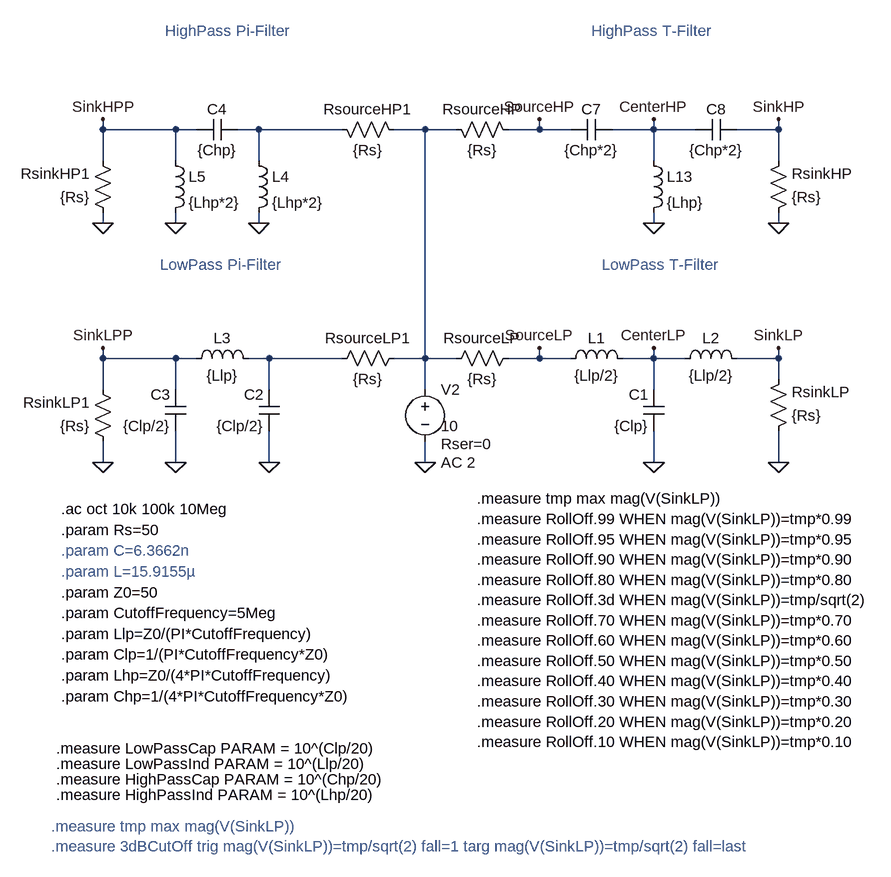
[diagram p0: schematic Filter.asc]
Filter.asc, the LTspice schematic file:
Version 4
SHEET 1 1248 680
WIRE -1056 -576 -1056 -592
WIRE -944 -576 -1056 -576
WIRE -912 -576 -944 -576
WIRE -816 -576 -848 -576
WIRE -688 -576 -816 -576
WIRE -560 -576 -608 -576
WIRE -512 -576 -560 -576
WIRE -384 -576 -384 -592
WIRE -384 -576 -432 -576
WIRE -336 -576 -384 -576
WIRE -208 -576 -208 -592
WIRE -208 -576 -272 -576
WIRE -144 -576 -208 -576
WIRE -16 -576 -16 -592
WIRE -16 -576 -80 -576
WIRE -1056 -528 -1056 -576
WIRE -944 -528 -944 -576
WIRE -816 -528 -816 -576
WIRE -208 -528 -208 -576
WIRE -16 -528 -16 -576
WIRE -1056 -432 -1056 -448
WIRE -944 -432 -944 -448
WIRE -816 -432 -816 -448
WIRE -208 -432 -208 -448
WIRE -16 -432 -16 -448
WIRE -1056 -224 -1056 -240
WIRE -944 -224 -1056 -224
WIRE -912 -224 -944 -224
WIRE -800 -224 -832 -224
WIRE -688 -224 -800 -224
WIRE -560 -224 -560 -576
WIRE -560 -224 -608 -224
WIRE -512 -224 -560 -224
WIRE -384 -224 -384 -240
WIRE -384 -224 -432 -224
WIRE -336 -224 -384 -224
WIRE -208 -224 -208 -240
WIRE -208 -224 -256 -224
WIRE -160 -224 -208 -224
WIRE -16 -224 -16 -240
WIRE -16 -224 -80 -224
WIRE -16 -192 -16 -224
WIRE -1056 -176 -1056 -224
WIRE -944 -176 -944 -224
WIRE -800 -176 -800 -224
WIRE -560 -176 -560 -224
WIRE -208 -176 -208 -224
WIRE -1056 -64 -1056 -96
WIRE -944 -64 -944 -112
WIRE -800 -64 -800 -112
WIRE -560 -64 -560 -96
WIRE -208 -64 -208 -112
WIRE -16 -64 -16 -112
FLAG -560 -64 0
FLAG -16 -64 0
FLAG -208 -64 0
FLAG -384 -240 SourceLP
FLAG -16 -240 SinkLP
FLAG -208 -240 CenterLP
FLAG -208 -432 0
FLAG -16 -432 0
FLAG -16 -592 SinkHP
FLAG -384 -592 SourceHP
FLAG -208 -592 CenterHP
FLAG -800 -64 0
FLAG -1056 -64 0
FLAG -944 -64 0
FLAG -1056 -240 SinkLPP
FLAG -816 -432 0
FLAG -944 -432 0
FLAG -1056 -432 0
FLAG -1056 -592 SinkHPP
SYMBOL voltage -560 -192 R0
WINDOW 3 24 72 Left 2
WINDOW 39 24 100 Left 2
WINDOW 123 24 128 Left 2
SYMATTR Value 10
SYMATTR SpiceLine Rser=0
SYMATTR Value2 AC 2
SYMATTR InstName V2
SYMBOL cap -192 -112 R180
WINDOW 0 24 56 Left 2
WINDOW 3 24 8 Left 2
SYMATTR InstName C1
SYMATTR Value {Clp}
SYMBOL ind -352 -208 R270
WINDOW 0 32 56 VTop 2
WINDOW 3 5 56 VBottom 2
SYMATTR InstName L1
SYMATTR Value {Llp/2}
SYMBOL res -416 -240 R90
WINDOW 0 0 56 VBottom 2
WINDOW 3 32 56 VTop 2
SYMATTR InstName RsourceLP
SYMATTR Value {Rs}
SYMBOL res -32 -96 M180
WINDOW 0 36 76 Left 2
WINDOW 3 36 40 Left 2
SYMATTR InstName RsinkLP
SYMATTR Value {Rs}
SYMBOL ind -176 -208 R270
WINDOW 0 32 56 VTop 2
WINDOW 3 5 56 VBottom 2
SYMATTR InstName L2
SYMATTR Value {Llp/2}
SYMBOL res -528 -592 M90
WINDOW 0 0 56 VBottom 2
WINDOW 3 32 56 VTop 2
SYMATTR InstName RsourceHP
SYMATTR Value {Rs}
SYMBOL cap -336 -560 R270
WINDOW 0 32 32 VTop 2
WINDOW 3 0 32 VBottom 2
SYMATTR InstName C7
SYMATTR Value {Chp*2}
SYMBOL cap -144 -560 R270
WINDOW 0 32 32 VTop 2
WINDOW 3 0 32 VBottom 2
SYMATTR InstName C8
SYMATTR Value {Chp*2}
SYMBOL ind -224 -544 R0
SYMATTR InstName L13
SYMATTR Value {Lhp}
SYMBOL res -32 -432 M180
WINDOW 0 36 76 Left 2
WINDOW 3 36 40 Left 2
SYMATTR InstName RsinkHP
SYMATTR Value {Rs}
SYMBOL cap -784 -112 R180
WINDOW 0 24 56 Left 2
WINDOW 3 24 8 Left 2
SYMATTR InstName C2
SYMATTR Value {Clp/2}
SYMBOL res -1040 -80 R180
WINDOW 0 36 76 Left 2
WINDOW 3 36 40 Left 2
SYMATTR InstName RsinkLP1
SYMATTR Value {Rs}
SYMBOL res -592 -240 R90
WINDOW 0 0 56 VBottom 2
WINDOW 3 32 56 VTop 2
SYMATTR InstName RsourceLP1
SYMATTR Value {Rs}
SYMBOL cap -928 -112 R180
WINDOW 0 24 56 Left 2
WINDOW 3 24 8 Left 2
SYMATTR InstName C3
SYMATTR Value {Clp/2}
SYMBOL ind -928 -208 R270
WINDOW 0 32 56 VTop 2
WINDOW 3 5 56 VBottom 2
SYMATTR InstName L3
SYMATTR Value {Llp}
SYMBOL cap -912 -560 R270
WINDOW 0 32 32 VTop 2
WINDOW 3 0 32 VBottom 2
SYMATTR InstName C4
SYMATTR Value {Chp}
SYMBOL ind -832 -544 R0
SYMATTR InstName L4
SYMATTR Value {Lhp*2}
SYMBOL ind -960 -544 R0
SYMATTR InstName L5
SYMATTR Value {Lhp*2}
SYMBOL res -1040 -432 R180
WINDOW 0 36 76 Left 2
WINDOW 3 36 40 Left 2
SYMATTR InstName RsinkHP1
SYMATTR Value {Rs}
SYMBOL res -704 -592 M90
WINDOW 0 0 56 VBottom 2
WINDOW 3 32 56 VTop 2
SYMATTR InstName RsourceHP1
SYMATTR Value {Rs}
TEXT -1120 8 Left 2 !.ac oct 10k 100k 10Meg
TEXT -1120 40 Left 2 !.param Rs=50
TEXT -1120 72 Left 2 ;.param C=6.3662n
TEXT -960 -728 Left 2 ;HighPass Pi-Filter
TEXT -304 -728 Left 2 ;HighPass T-Filter
TEXT -968 -368 Left 2 ;LowPass Pi-Filter
TEXT -288 -368 Left 2 ;LowPass T-Filter
TEXT -1120 104 Left 2 ;.param L=15.9155µ
TEXT -1120 232 Left 2 !.param Clp=1/(PI*CutoffFrequency*Z0)
TEXT -1120 136 Left 2 !.param Z0=50
TEXT -1120 168 Left 2 !.param CutoffFrequency=5Meg
TEXT -1120 200 Left 2 !.param Llp=Z0/(PI*CutoffFrequency)
TEXT -480 -8 Left 2 !.measure tmp max mag(V(SinkLP))\n.measure RollOff.99 WHEN mag(V(SinkLP))=tmp*0.99\n.measure RollOff.95 WHEN mag(V(SinkLP))=tmp*0.95\n.measure RollOff.90 WHEN mag(V(SinkLP))=tmp*0.90\n.measure RollOff.80 WHEN mag(V(SinkLP))=tmp*0.80\n.measure RollOff.3d WHEN mag(V(SinkLP))=tmp/sqrt(2)\n.measure RollOff.70 WHEN mag(V(SinkLP))=tmp*0.70\n.measure RollOff.60 WHEN mag(V(SinkLP))=tmp*0.60\n.measure RollOff.50 WHEN mag(V(SinkLP))=tmp*0.50\n.measure RollOff.40 WHEN mag(V(SinkLP))=tmp*0.40\n.measure RollOff.30 WHEN mag(V(SinkLP))=tmp*0.30\n.measure RollOff.20 WHEN mag(V(SinkLP))=tmp*0.20\n.measure RollOff.10 WHEN mag(V(SinkLP))=tmp*0.10
TEXT -1136 496 Left 2 ;.measure tmp max mag(V(SinkLP))\n.measure 3dBCutOff trig mag(V(SinkLP))=tmp/sqrt(2) fall=1 targ mag(V(SinkLP))=tmp/sqrt(2) fall=last
TEXT -1128 400 Left 2 !.measure LowPassInd PARAM = 10^(Llp/20)
TEXT -1128 376 Left 2 !.measure LowPassCap PARAM = 10^(Clp/20)
TEXT -1120 264 Left 2 !.param Lhp=Z0/(4*PI*CutoffFrequency)
TEXT -1120 296 Left 2 !.param Chp=1/(4*PI*CutoffFrequency*Z0)
TEXT -1128 448 Left 2 !.measure HighPassInd PARAM = 10^(Lhp/20)
TEXT -1128 424 Left 2 !.measure HighPassCap PARAM = 10^(Chp/20)

The netlist it stands for:
* Filter.asc
V2 N002 0 10 AC 2 Rser=0
C1 0 CenterLP {Clp}
L1 SourceLP CenterLP {Llp/2}
RsourceLP SourceLP N002 {Rs}
RsinkLP 0 SinkLP {Rs}
L2 CenterLP SinkLP {Llp/2}
RsourceHP N002 SourceHP {Rs}
C7 SourceHP CenterHP {Chp*2}
C8 CenterHP SinkHP {Chp*2}
L13 CenterHP 0 {Lhp}
RsinkHP 0 SinkHP {Rs}
C2 0 N003 {Clp/2}
RsinkLP1 0 SinkLPP {Rs}
RsourceLP1 N002 N003 {Rs}
C3 0 SinkLPP {Clp/2}
L3 SinkLPP N003 {Llp}
C4 SinkHPP N001 {Chp}
L4 N001 0 {Lhp*2}
L5 SinkHPP 0 {Lhp*2}
RsinkHP1 0 SinkHPP {Rs}
RsourceHP1 N001 N002 {Rs}
.ac oct 10k 100k 10Meg
.param Rs=50
* .param C=6.3662n
* HighPass Pi-Filter
* HighPass T-Filter
* LowPass Pi-Filter
* LowPass T-Filter
* .param L=15.9155µ
.param Clp=1/(PI*CutoffFrequency*Z0)
.param Z0=50
.param CutoffFrequency=5Meg
.param Llp=Z0/(PI*CutoffFrequency)
.measure tmp max mag(V(SinkLP))
.measure RollOff.99 WHEN mag(V(SinkLP))=tmp*0.99
.measure RollOff.95 WHEN mag(V(SinkLP))=tmp*0.95
.measure RollOff.90 WHEN mag(V(SinkLP))=tmp*0.90
.measure RollOff.80 WHEN mag(V(SinkLP))=tmp*0.80
.measure RollOff.3d WHEN mag(V(SinkLP))=tmp/sqrt(2)
.measure RollOff.70 WHEN mag(V(SinkLP))=tmp*0.70
.measure RollOff.60 WHEN mag(V(SinkLP))=tmp*0.60
.measure RollOff.50 WHEN mag(V(SinkLP))=tmp*0.50
.measure RollOff.40 WHEN mag(V(SinkLP))=tmp*0.40
.measure RollOff.30 WHEN mag(V(SinkLP))=tmp*0.30
.measure RollOff.20 WHEN mag(V(SinkLP))=tmp*0.20
.measure RollOff.10 WHEN mag(V(SinkLP))=tmp*0.10
* .measure tmp max mag(V(SinkLP))
* .measure 3dBCutOff trig mag(V(SinkLP))=tmp/sqrt(2) fall=1 targ mag(V(SinkLP))=tmp/sqrt(2) fall=last
.measure LowPassInd PARAM = 10^(Llp/20)
.measure LowPassCap PARAM = 10^(Clp/20)
.param Lhp=Z0/(4*PI*CutoffFrequency)
.param Chp=1/(4*PI*CutoffFrequency*Z0)
.measure HighPassInd PARAM = 10^(Lhp/20)
.measure HighPassCap PARAM = 10^(Chp/20)
.backanno
.end